# Altium schematic sheet H0AR6_Frontend.SchDoc
size Letter; CompanyName: Hexabitz; DocumentNumber: 3; SheetNumber: 2; SheetTotal: 2
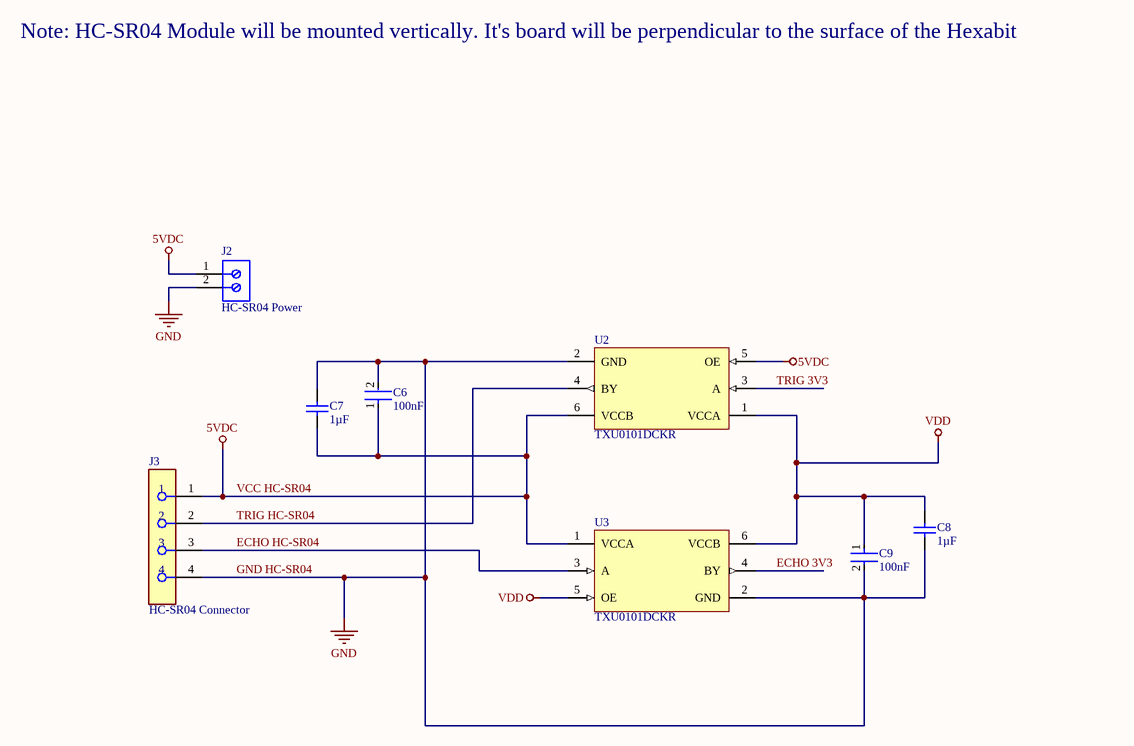
[diagram p0: H0AR6_Frontend.SchDoc]

## Parts
C6  100nF  [FP-0603-L_1_6_0_15-W_0_81-MFG]
C7  1µF  [CAPC1608X90X35LL15T15]
C8  1µF  [CAPC1608X90X35LL15T15]
C9  100nF  [FP-0603-L_1_6_0_15-W_0_81-MFG]
J2  HC-SR04 Power  [691214110002]
J3  HC-SR04 Connector  [FP-SSW-104-02-G-S-MFG]
U2  TXU0101DCKR  [FP-DCK0006A-MFG]
U3  TXU0101DCKR  [FP-DCK0006A-MFG]

## Nets
GND HC-SR04: C6.2 C7.2 C8.2 C9.2 J2.2 J3.4 U2.2(GND) U3.2(GND)  [also labelled GND]
VCC HC-SR04: C6.1 C7.1 J2.1 J3.1 U2.5(OE) U2.6(VCCB) U3.1(VCCA)  [also labelled 5VDC]
VDD: C8.1 C9.1 U2.1(VCCA) U3.5(OE) U3.6(VCCB)
ECHO 3V3: U3.4(BY)
ECHO HC-SR04: J3.3 U3.3(A)
TRIG 3V3: U2.3(A)
TRIG HC-SR04: J3.2 U2.4(BY)

## Notes on the sheet
- Note: HC-SR04 Module will be mounted vertically. It's board will be perpendicular to the surface of the Hexabit
- Module:
- Title:
- Description:
- Size:
- Revision:
- Letter
- www.hexabitz.com
- Date:
- Time:
- Sheet
- of

## Library data of the parts
C6 C9 = CMP-1035-02592-4: General Purpose Ceramic Capacitor, 0603, 100nF, 10%, X7R, 15%, 50V; Manufacturer: KYOCERA AVX; Manufacturer Part Number: 06035C104KAT2A; Dissipation Factor: 2.5%; Radiation Hardening: No; Termination: SMD/SMT; Tolerance: 10%; Lead Free: Lead Free; Width: 0.81mm; Max Operating Temperature: 125°C; Thickness: 0.035inch; Voltage Rating: 50V; Height: 0.9mm; Case/Package: 0603; Depth: 0.81mm; Number of Pins: 2; Capacitance: 100nF; REACH SVHC: No SVHC; Case Code (Imperial): 0603; Voltage: 50V; Voltage Rating (DC): 50V; Mount: Surface Mount; Length: 1.6mm; Min Operating Temperature: -55°C; Packaging: Tape and Reel; Case Code (Metric): 1608; Dielectric Material: Ceramic; Package Quantity: 1; Dielectric: X7R; Contact Plating: Tin; Supplier: Future Electronics; Supplier Part Number: 5411970; RoHS: Compliant; Category: Ceramic Capacitors; Stock: 4736000; Pricing: 4000=0.0065, 16000=0.0062, 40000=0.0061, 100000=0.0059, 160000=0.0057 (USD); Value: 100nF; China RoHS: Compliant; Lifecycle Status: Production; Material: Ceramic; Mounting Technology: Surface Mount; Pins: 2; Number of Terminals: 2; Schedule B: 8532240020; Voltage Rating (AC): 50V; ComponentLink1URL: https://datasheet.octopart.com:443/06035C104KAT2A-KYOCERA-AVX-datasheet-170560559.pdf?src-supplier=IHS; ComponentLink1Description: https://datasheet.octopart.com:443/06035C104KAT2A-KYOCERA-AVX-datasheet-170560559.pdf?src-supplier=IHS; ComponentLink2URL: https://datasheet.octopart.com:443/06035C104KAT2A-AVX-datasheet-12587061.pdf?src-supplier=Upverter; ComponentLink2Description: https://datasheet.octopart.com:443/06035C104KAT2A-AVX-datasheet-12587061.pdf?src-supplier=Upverter; ComponentLink3URL: https://datasheet.octopart.com:443/06035C104KAT2A-AVX-datasheet-167033.pdf?src-supplier=Upverter; ComponentLink3Description: https://datasheet.octopart.com:443/06035C104KAT2A-AVX-datasheet-167033.pdf?src-supplier=Upverter; ComponentLink4URL: https://datasheet.octopart.com:443/06035C104KAT2A-AVX-datasheet-12509786.pdf?src-supplier=Upverter; ComponentLink4Description: https://datasheet.octopart.com:443/06035C104KAT2A-AVX-datasheet-12509786.pdf?src-supplier=Upverter; ComponentLink5URL: https://datasheet.octopart.com:443/06035C104KAT2A-AVX-datasheet-8113618.pdf?src-supplier=Upverter; ComponentLink5Description: https://datasheet.octopart.com:443/06035C104KAT2A-AVX-datasheet-8113618.pdf?src-supplier=Upverter; ComponentLink6URL: https://datasheet.octopart.com:443/06035C104KAT2A-AVX-datasheet-5313617.pdf?src-supplier=Upverter; ComponentLink6Description: https://datasheet.octopart.com:443/06035C104KAT2A-AVX-datasheet-5313617.pdf?src-supplier=Upverter; ComponentLink7URL: https://datasheet.octopart.com:443/06035C104KAT2A-KYOCERA-AVX-datasheet-50865067.pdf?src-supplier=Upverter; ComponentLink7Description: https://datasheet.octopart.com:443/06035C104KAT2A-KYOCERA-AVX-datasheet-50865067.pdf?src-supplier=Upverter; ComponentLink8URL: https://sigma.octopart.com:443/147443767/technical_drawing/AVX-06035C104KAT2A.pdf?src-supplier=Upverter; ComponentLink8Description: https://sigma.octopart.com:443/147443767/technical_drawing/AVX-06035C104KAT2A.pdf?src-supplier=Upverter; ComponentLink9URL: https://datasheet.octopart.com:443/06035C104KAT2A-AVX-datasheet-59261641.pdf?src-supplier=Upverter; ComponentLink9Description: https://datasheet.octopart.com:443/06035C104KAT2A-AVX-datasheet-59261641.pdf?src-supplier=Upverter; ComponentLink10URL: https://datasheet.octopart.com:443/06035C104KAT2A-KYOCERA-AVX-datasheet-158983632.pdf?src-supplier=Newark; ComponentLink10Description: https://datasheet.octopart.com:443/06035C104KAT2A-KYOCERA-AVX-datasheet-158983632.pdf?src-supplier=Newark; ComponentLink11URL: https://datasheet.octopart.com:443/06035C104KAT2A-AVX-datasheet-78690206.pdf?src-supplier=Newark; ComponentLink11Description: https://datasheet.octopart.com:443/06035C104KAT2A-AVX-datasheet-78690206.pdf?src-supplier=Newark; ComponentLink12URL: https://datasheet.octopart.com:443/06035C104KAT2A-KYOCERA-AVX-datasheet-65931687.pdf?src-supplier=Newark; ComponentLink12Description: https://datasheet.octopart.com:443/06035C104KAT2A-KYOCERA-AVX-datasheet-65931687.pdf?src-supplier=Newark; ComponentLink13URL: https://datasheet.octopart.com/06035C104KAT2A-AVX---Kyocera-datasheet-13516023.pdf; ComponentLink13Description: https://datasheet.octopart.com/06035C104KAT2A-AVX---Kyocera-datasheet-13516023.pdf; ComponentLink14URL: https://datasheet.octopart.com/Commercial-Surface-Mount-Chips---X7R-Dielectric-AVX-datasheet-family-100.pdf; ComponentLink14Description: https://datasheet.octopart.com/Commercial-Surface-Mount-Chips---X7R-Dielectric-AVX-datasheet-family-100.pdf; ComponentLink15URL: https://datasheet.octopart.com:443/06035C104KAT2A-AVX---Kyocera-datasheet-8446237.pdf?src-supplier=TME; ComponentLink15Description: https://datasheet.octopart.com:443/06035C104KAT2A-AVX---Kyocera-datasheet-8446237.pdf?src-supplier=TME; ComponentLink16URL: https://datasheet.octopart.com:443/06035C104KAT2A-AVX-datasheet-148183.pdf?src-supplier=TME; ComponentLink16Description: https://datasheet.octopart.com:443/06035C104KAT2A-AVX-datasheet-148183.pdf?src-supplier=TME; ComponentLink17URL: https://datasheet.octopart.com:443/06035C104KAT2A-KYOCERA-AVX-datasheet-156093841.pdf?src-supplier=TME; ComponentLink17Description: https://datasheet.octopart.com:443/06035C104KAT2A-KYOCERA-AVX-datasheet-156093841.pdf?src-supplier=TME; ComponentLink18URL: https://datasheet.octopart.com:443/06035C104KAT2A-AVX-datasheet-166051239.pdf?src-supplier=Amar+Radio+Corporation; ComponentLink18Description: https://datasheet.octopart.com:443/06035C104KAT2A-AVX-datasheet-166051239.pdf?src-supplier=Amar+Radio+Corporation; ComponentLink19URL: https://datasheet.octopart.com:443/06035C104KAT2A-AVX-datasheet-136835410.pdf?src-supplier=SOS+electronic; ComponentLink19Description: https://datasheet.octopart.com:443/06035C104KAT2A-AVX-datasheet-136835410.pdf?src-supplier=SOS+electronic; ComponentLink20URL: https://datasheet.octopart.com:443/06035C104KAT2A-AVX-datasheet-11546901.pdf?src-supplier=Arrow+Electronics; ComponentLink20Description: https://datasheet.octopart.com:443/06035C104KAT2A-AVX-datasheet-11546901.pdf?src-supplier=Arrow+Electronics; ComponentLink21URL: https://datasheet.octopart.com:443/06035C104KAT2A-AVX-datasheet-8316804.pdf?src-supplier=Garrett; ComponentLink21Description: https://datasheet.octopart.com:443/06035C104KAT2A-AVX-datasheet-8316804.pdf?src-supplier=Garrett; ComponentLink22URL: https://datasheet.octopart.com:443/06035C104KAT2A-AVX-datasheet-5383.pdf?src-supplier=Garrett; ComponentLink22Description: https://datasheet.octopart.com:443/06035C104KAT2A-AVX-datasheet-5383.pdf?src-supplier=Garrett; ComponentLink23URL: https://datasheet.octopart.com:443/06035C104KAT2A-AVX-datasheet-7834807.pdf?src-supplier=Jameco; ComponentLink23Description: https://datasheet.octopart.com:443/06035C104KAT2A-AVX-datasheet-7834807.pdf?src-supplier=Jameco; ComponentLink24URL: https://datasheet.octopart.com:443/06035C104KAT2A-AVX-datasheet-119053.pdf?src-supplier=Farnell; ComponentLink24Description: https://datasheet.octopart.com:443/06035C104KAT2A-AVX-datasheet-119053.pdf?src-supplier=Farnell; ComponentLink25URL: https://datasheet.octopart.com:443/06035C104KAT2A-AVX-datasheet-499018.pdf?src-supplier=Farnell; ComponentLink25Description: https://datasheet.octopart.com:443/06035C104KAT2A-AVX-datasheet-499018.pdf?src-supplier=Farnell; ComponentLink26URL: https://datasheet.octopart.com:443/06035C104KAT2A-AVX-datasheet-4352.pdf?src-supplier=RS+(Formerly+Allied+Electronics); ComponentLink26Description: https://datasheet.octopart.com:443/06035C104KAT2A-AVX-datasheet-4352.pdf?src-supplier=RS+(Formerly+Allied+Electronics); ComponentLink27URL: http://sigma.octopart.com:80/reach_statement/AVX-company-19.pdf?src-supplier=Compliance+Statements; ComponentLink27Description: http://sigma.octopart.com:80/reach_statement/AVX-company-19.pdf?src-supplier=Compliance+Statements; ComponentLink28URL: http://sigma.octopart.com:80/conflict_mineral_statement/AVX-company-34.pdf?src-supplier=Compliance+Statements; ComponentLink28Description: http://sigma.octopart.com:80/conflict_mineral_statement/AVX-company-34.pdf?src-supplier=Compliance+Statements
C7 C8 = CMP-2006-02298-2: Manufacturer: Kemet; Part Number: C0603C105K4RACTU; Dielectric: X7R; Dielectric Material: Ceramic; Dissipation Factor: 3.5%; Tolerance: 10%; Voltage: 16V; Supplier: Avnet; Supplier Part Number: C0603C105K4RACTU; Manufacturer Part Number: C0603C105K4RACTU; RoHS: Compliant; Category: Ceramic Capacitors; Stock: 276000; Pricing: 4000=0.0092, 8000=0.00897, 16000=0.00869, 32000=0.00842, 64000=0.00826 (USD); Value: 1µF; Case/Package: 0603; Case Code (Imperial): 0603; Case Code (Metric): 1608; China RoHS: Compliant; Contact Plating: Tin; Depth: 800µm; Height: 800µm; Length: 1.6mm; Lifecycle Status: Production; Material: Ceramic; Max Operating Temperature: 125°C; Min Operating Temperature: -55°C; Mounting Technology: Surface Mount; Pins: 2; Number of Terminals: 2; Packaging: Cut Tape; Radiation Hardening: No; REACH SVHC: Yes; Schedule B: 8532240020, 8532240020|8532240020|8532240020|8532240020|8532240020; Termination: SMD/SMT; Thickness: 889µm; Voltage Rating: 16V; Voltage Rating (DC): 16V; Width: 800µm; ComponentLink1URL: https://datasheet.octopart.com:443/C0603C105K4RACTU-KEMET-datasheet-178445679.pdf?src-supplier=IHS; ComponentLink1Description: https://datasheet.octopart.com:443/C0603C105K4RACTU-KEMET-datasheet-178445679.pdf?src-supplier=IHS; ComponentLink2URL: https://datasheet.octopart.com:443/C0603C105K4RACTU-KEMET-datasheet-137357759.pdf?src-supplier=Farnell; ComponentLink2Description: https://datasheet.octopart.com:443/C0603C105K4RACTU-KEMET-datasheet-137357759.pdf?src-supplier=Farnell; ComponentLink3URL: https://datasheet.octopart.com:443/C0603C105K4RACTU-Kemet-datasheet-8764837.pdf?src-supplier=Farnell; ComponentLink3Description: https://datasheet.octopart.com:443/C0603C105K4RACTU-Kemet-datasheet-8764837.pdf?src-supplier=Farnell; ComponentLink4URL: https://datasheet.octopart.com:443/C0603C105K4RACTU-Kemet-datasheet-8480123.pdf?src-supplier=Farnell; ComponentLink4Description: https://datasheet.octopart.com:443/C0603C105K4RACTU-Kemet-datasheet-8480123.pdf?src-supplier=Farnell; ComponentLink5URL: https://datasheet.octopart.com:443/C0603C105K4RAC-TU.-Kemet-datasheet-5313890.pdf?src-supplier=Farnell; ComponentLink5Description: https://datasheet.octopart.com:443/C0603C105K4RAC-TU.-Kemet-datasheet-5313890.pdf?src-supplier=Farnell; ComponentLink6URL: https://datasheet.octopart.com:443/C0603C105K4RAC-TU-Kemet-datasheet-5390537.pdf?src-supplier=Farnell; ComponentLink6Description: https://datasheet.octopart.com:443/C0603C105K4RAC-TU-Kemet-datasheet-5390537.pdf?src-supplier=Farnell; ComponentLink7URL: https://datasheet.octopart.com:443/C0603C105K4RACTU-Kemet-datasheet-5393970.pdf?src-supplier=Farnell; ComponentLink7Description: https://datasheet.octopart.com:443/C0603C105K4RACTU-Kemet-datasheet-5393970.pdf?src-supplier=Farnell; ComponentLink8URL: https://datasheet.octopart.com:443/C0603C105K4RACTU-Kemet-datasheet-8502025.pdf?src-supplier=Farnell; ComponentLink8Description: https://datasheet.octopart.com:443/C0603C105K4RACTU-Kemet-datasheet-8502025.pdf?src-supplier=Farnell; ComponentLink9URL: https://datasheet.octopart.com:443/C0603C105K4RAC-TU-Kemet-datasheet-7541751.pdf?src-supplier=Farnell; ComponentLink9Description: https://datasheet.octopart.com:443/C0603C105K4RAC-TU-Kemet-datasheet-7541751.pdf?src-supplier=Farnell; ComponentLink10URL: https://datasheet.octopart.com:443/C0603C105K4RACTU-Kemet-datasheet-161801.pdf?src-supplier=Farnell; ComponentLink10Description: https://datasheet.octopart.com:443/C0603C105K4RACTU-Kemet-datasheet-161801.pdf?src-supplier=Farnell; ComponentLink11URL: https://datasheet.octopart.com:443/C0603C105K4RACTU-KEMET-datasheet-101575666.pdf?src-supplier=Farnell; ComponentLink11Description: https://datasheet.octopart.com:443/C0603C105K4RACTU-KEMET-datasheet-101575666.pdf?src-supplier=Farnell; ComponentLink12URL: https://datasheet.octopart.com:443/C0603C105K4RAC-TU-Kemet-datasheet-7833651.pdf?src-supplier=Farnell; ComponentLink12Description: https://datasheet.octopart.com:443/C0603C105K4RAC-TU-Kemet-datasheet-7833651.pdf?src-supplier=Farnell; ComponentLink13URL: https://datasheet.octopart.com:443/C0603C105K4RAC-TU-Kemet-datasheet-7601896.pdf?src-supplier=Farnell; ComponentLink13Description: https://datasheet.octopart.com:443/C0603C105K4RAC-TU-Kemet-datasheet-7601896.pdf?src-supplier=Farnell; ComponentLink14URL: https://datasheet.octopart.com:443/C0603C105K4RAC-TU-Kemet-datasheet-5316294.pdf?src-supplier=Farnell; ComponentLink14Description: https://datasheet.octopart.com:443/C0603C105K4RAC-TU-Kemet-datasheet-5316294.pdf?src-supplier=Farnell; ComponentLink15URL: https://datasheet.octopart.com:443/C0603C105K4RAC-TU-Kemet-datasheet-5314837.pdf?src-supplier=Farnell; ComponentLink15Description: https://datasheet.octopart.com:443/C0603C105K4RAC-TU-Kemet-datasheet-5314837.pdf?src-supplier=Farnell; ComponentLink16URL: https://datasheet.octopart.com:443/C0603C105K4RAC-TU-Kemet-datasheet-8092359.pdf?src-supplier=Farnell; ComponentLink16Description: https://datasheet.octopart.com:443/C0603C105K4RAC-TU-Kemet-datasheet-8092359.pdf?src-supplier=Farnell; ComponentLink17URL: https://datasheet.octopart.com:443/C0603C105K4RAC-TU-Kemet-datasheet-5314449.pdf?src-supplier=Farnell; ComponentLink17Description: https://datasheet.octopart.com:443/C0603C105K4RAC-TU-Kemet-datasheet-5314449.pdf?src-supplier=Farnell; ComponentLink18URL: https://datasheet.octopart.com:443/C0603C105K4RAC-TU-Kemet-datasheet-5314969.pdf?src-supplier=Farnell; ComponentLink18Description: https://datasheet.octopart.com:443/C0603C105K4RAC-TU-Kemet-datasheet-5314969.pdf?src-supplier=Farnell; ComponentLink19URL: https://datasheet.octopart.com:443/C0603C105K4RAC-TU-Kemet-datasheet-5314627.pdf?src-supplier=Farnell; ComponentLink19Description: https://datasheet.octopart.com:443/C0603C105K4RAC-TU-Kemet-datasheet-5314627.pdf?src-supplier=Farnell; ComponentLink20URL: https://datasheet.octopart.com:443/C0603C105K4RAC-TU-Kemet-datasheet-5389132.pdf?src-supplier=Farnell; ComponentLink20Description: https://datasheet.octopart.com:443/C0603C105K4RAC-TU-Kemet-datasheet-5389132.pdf?src-supplier=Farnell; ComponentLink21URL: https://datasheet.octopart.com:443/C0603C105K4RAC-TU-Kemet-datasheet-5313836.pdf?src-supplier=Farnell; ComponentLink21Description: https://datasheet.octopart.com:443/C0603C105K4RAC-TU-Kemet-datasheet-5313836.pdf?src-supplier=Farnell; ComponentLink22URL: https://datasheet.octopart.com:443/C0603C105K4RAC-TU-Kemet-datasheet-8111010.pdf?src-supplier=Farnell; ComponentLink22Description: https://datasheet.octopart.com:443/C0603C105K4RAC-TU-Kemet-datasheet-8111010.pdf?src-supplier=Farnell; ComponentLink23URL: https://datasheet.octopart.com:443/C0603C105K4RAC-TU-Kemet-datasheet-7627733.pdf?src-supplier=Farnell; ComponentLink23Description: https://datasheet.octopart.com:443/C0603C105K4RAC-TU-Kemet-datasheet-7627733.pdf?src-supplier=Farnell; ComponentLink24URL: https://datasheet.octopart.com:443/C0603C105K4RAC-TU-Kemet-datasheet-5315946.pdf?src-supplier=Farnell; ComponentLink24Description: https://datasheet.octopart.com:443/C0603C105K4RAC-TU-Kemet-datasheet-5315946.pdf?src-supplier=Farnell; ComponentLink25URL: https://datasheet.octopart.com:443/C0603C105K4RAC7867-KEMET-datasheet-188512054.pdf?src-supplier=ODG+(Origin+Data+Global); ComponentLink25Description: https://datasheet.octopart.com:443/C0603C105K4RAC7867-KEMET-datasheet-188512054.pdf?src-supplier=ODG+(Origin+Data+Global); ComponentLink26URL: https://datasheet.octopart.com:443/C0603C105K4RACTU-KEMET-datasheet-157246124.pdf?src-supplier=Electro+Sonic; ComponentLink26Description: https://datasheet.octopart.com:443/C0603C105K4RACTU-KEMET-datasheet-157246124.pdf?src-supplier=Electro+Sonic; ComponentLink27URL: https://datasheet.octopart.com:443/C0603C105K4RACTU-KEMET-datasheet-32036385.pdf?src-supplier=Electro+Sonic; ComponentLink27Description: https://datasheet.octopart.com:443/C0603C105K4RACTU-KEMET-datasheet-32036385.pdf?src-supplier=Electro+Sonic; ComponentLink28URL: https://datasheet.octopart.com:443/C0603C105K4RACTU-Kemet-datasheet-22084244.pdf?src-supplier=Newark; ComponentLink28Description: https://datasheet.octopart.com:443/C0603C105K4RACTU-Kemet-datasheet-22084244.pdf?src-supplier=Newark; ComponentLink29URL: https://datasheet.octopart.com:443/C0603C105K4RACTU-Kemet-datasheet-12608295.pdf?src-supplier=Newark; ComponentLink29Description: https://datasheet.octopart.com:443/C0603C105K4RACTU-Kemet-datasheet-12608295.pdf?src-supplier=Newark; ComponentLink30URL: https://datasheet.octopart.com:443/C0603C105K4RACTU-Kemet-datasheet-11992184.pdf?src-supplier=Newark; ComponentLink30Description: https://datasheet.octopart.com:443/C0603C105K4RACTU-Kemet-datasheet-11992184.pdf?src-supplier=Newark; ComponentLink31URL: https://datasheet.octopart.com:443/C0603C105K4RACTU-Kemet-datasheet-10942409.pdf?src-supplier=Newark; ComponentLink31Description: https://datasheet.octopart.com:443/C0603C105K4RACTU-Kemet-datasheet-10942409.pdf?src-supplier=Newark; ComponentLink32URL: https://datasheet.octopart.com:443/C0603C105K4RACTU-Kemet-datasheet-10404442.pdf?src-supplier=Newark; ComponentLink32Description: https://datasheet.octopart.com:443/C0603C105K4RACTU-Kemet-datasheet-10404442.pdf?src-supplier=Newark; ComponentLink33URL: https://datasheet.octopart.com:443/C0603C105K4RACTU-KEMET-datasheet-164512540.pdf?src-supplier=TME; ComponentLink33Description: https://datasheet.octopart.com:443/C0603C105K4RACTU-KEMET-datasheet-164512540.pdf?src-supplier=TME; ComponentLink34URL: https://datasheet.octopart.com:443/C0603C105K4RACTU-KEMET-datasheet-68311255.pdf?src-supplier=TME; ComponentLink34Description: https://datasheet.octopart.com:443/C0603C105K4RACTU-KEMET-datasheet-68311255.pdf?src-supplier=TME; ComponentLink35URL: https://datasheet.octopart.com:443/C0603C105K4RACTU-KEMET-datasheet-68331906.pdf?src-supplier=TME; ComponentLink35Description: https://datasheet.octopart.com:443/C0603C105K4RACTU-KEMET-datasheet-68331906.pdf?src-supplier=TME; ComponentLink36URL: https://datasheet.octopart.com:443/C0603C105K4RACTU-KEMET-datasheet-110724412.pdf?src-supplier=RS+(Formerly+Allied+Electronics); ComponentLink36Description: https://datasheet.octopart.com:443/C0603C105K4RACTU-KEMET-datasheet-110724412.pdf?src-supplier=RS+(Formerly+Allied+Electronics); ComponentLink37URL: https://datasheet.octopart.com:443/C0603C105K4RACTU-Kemet-datasheet-60243841.pdf?src-supplier=RS+(Formerly+Allied+Electronics); ComponentLink37Description: https://datasheet.octopart.com:443/C0603C105K4RACTU-Kemet-datasheet-60243841.pdf?src-supplier=RS+(Formerly+Allied+Electronics); ComponentLink38URL: https://datasheet.octopart.com/C0603C105K4RACTU-KEMET-datasheet-84169754.pdf; ComponentLink38Description: https://datasheet.octopart.com/C0603C105K4RACTU-KEMET-datasheet-84169754.pdf; ComponentLink39URL: https://datasheet.octopart.com:443/C0603C105K4RACTU-Kemet-datasheet-24570007.pdf?src-supplier=element14+APAC; ComponentLink39Description: https://datasheet.octopart.com:443/C0603C105K4RACTU-Kemet-datasheet-24570007.pdf?src-supplier=element14+APAC; ComponentLink40URL: https://datasheet.octopart.com:443/C0603C105K4RACTU-Kemet-datasheet-21389240.pdf?src-supplier=element14+APAC; ComponentLink40Description: https://datasheet.octopart.com:443/C0603C105K4RACTU-Kemet-datasheet-21389240.pdf?src-supplier=element14+APAC; ComponentLink41URL: https://datasheet.octopart.com:443/C0603C105K4RACTU-Kemet-datasheet-11546808.pdf?src-supplier=Arrow+Electronics; ComponentLink41Description: https://datasheet.octopart.com:443/C0603C105K4RACTU-Kemet-datasheet-11546808.pdf?src-supplier=Arrow+Electronics; ComponentLink42URL: https://datasheet.octopart.com:443/C0603C105K4RAC7867-KEMET-datasheet-164857143.pdf?src-supplier=Burklin+Elektronik; ComponentLink42Description: https://datasheet.octopart.com:443/C0603C105K4RAC7867-KEMET-datasheet-164857143.pdf?src-supplier=Burklin+Elektronik
J2 = CMP-1502-02464-2: NexarPartId: 18818288; Plating: Brass, Steel; Current: 10A; Pitch: 3.5052mm; Number of Levels: 1; Number of Contacts: 2; Wire Gauge (Min): 16AWG; Voltage: 300V; Wire Gauge (Max): 24AWG; Stripping Length: -6mm; Number of Pins: 2; Number of Rows: 1; REACH SVHC: Unknown; RoHS: Compliant; Housing Material: Nylon; Termination: Screw; Mount: Through Hole; Contact Plating: Brass, Tin; Number of Positions Per Level: 2; Color: Blue, Green; Width: 7.9mm; Voltage Rating: 300V; Length: 7.4mm; Current Rating: 10A; Wire/Cable Gauge: 24AWG; Packaging: Box; Max Operating Temperature: 105°C; Lead Pitch: 3.5mm; Height: 8.7mm; Contact Material: Brass; Min Operating Temperature: -40°C
J3 = CMP-00575-00296407-1: SSW-104-02-G-S Board to Board & Mezzanine Connectors Tiger Buy Socket Strip with PCB Tails, .100 Pitch; NexarPartId: 296407; Manufacturer Lifecycle Status: PRODUCTION; Manufacturer: Samtec; Gender: Receptacle; Pitch: 2.54mm; Number of Positions: 4; Contact Resistance: 10mΩ; Connector Type: Receptacle, Socket; Voltage Rating: 550V; Max Current Rating: 6.9A; Voltage Rating (DC): 655V; Voltage Rating (AC): 465V; Current Rating: 4.7A; RoHS: Compliant; Lead Pitch: 2.54mm; Min Operating Temperature: -55°C; Housing Material: Polymer; Length: 10.67mm; Mount: Through Hole; Orientation: Straight; Lifecycle Status: Production; Lead Free: Lead Free; REACH SVHC: No SVHC; Number of Rows: 1; Contact Plating: Gold; Radiation Hardening: No; Max Operating Temperature: 125°C; Housing Color: Black; Height: 8.64mm; Contact Material: Bronze, Gold, Nickel; Width: 2.41mm; Number of Contacts: 4; Packaging: Bulk; Termination: Solder; Depth: 2.41mm; Max Voltage Rating (AC): 550V; Color: Black; Supplier: Avnet; Supplier Part Number: SSW-104-02-G-S; Manufacturer Part Number: SSW-104-02-G-S; Category: Headers and Wire Housings; Stock: 1239; Pricing: 1=1.372, 10=1.365, 30=0.96486, 50=0.95989, 100=0.95491 (USD); Mounting Technology: Through Hole; ComponentLink1URL: https://sigma.octopart.com:443/153594225/technical_drawing/Samtec-SSW-104-02-G-S.pdf?src-supplier=Upverter; ComponentLink1Description: https://sigma.octopart.com:443/153594225/technical_drawing/Samtec-SSW-104-02-G-S.pdf?src-supplier=Upverter; ComponentLink2URL: https://datasheet.octopart.com:443/SSW-104-02-G-S-Samtec-datasheet-153594224.pdf?src-supplier=Upverter; ComponentLink2Description: https://datasheet.octopart.com:443/SSW-104-02-G-S-Samtec-datasheet-153594224.pdf?src-supplier=Upverter; ComponentLink3URL: https://datasheet.octopart.com:443/SSW-104-02-G-S-Samtec-datasheet-97292260.pdf?src-supplier=Samtec; ComponentLink3Description: https://datasheet.octopart.com:443/SSW-104-02-G-S-Samtec-datasheet-97292260.pdf?src-supplier=Samtec; ComponentLink4URL: https://sigma.octopart.com:443/97292261/technical_drawing/Samtec-SSW-104-02-G-S.pdf?src-supplier=Samtec; ComponentLink4Description: https://sigma.octopart.com:443/97292261/technical_drawing/Samtec-SSW-104-02-G-S.pdf?src-supplier=Samtec; ComponentLink5URL: https://datasheet.octopart.com:443/SSW-104-02-G-S-Samtec-datasheet-150000281.pdf?src-supplier=Master+Electronics; ComponentLink5Description: https://datasheet.octopart.com:443/SSW-104-02-G-S-Samtec-datasheet-150000281.pdf?src-supplier=Master+Electronics; ComponentLink6URL: https://datasheet.octopart.com:443/SSW-104-02-G-S-Samtec-datasheet-118235310.pdf?src-supplier=Electro+Sonic; ComponentLink6Description: https://datasheet.octopart.com:443/SSW-104-02-G-S-Samtec-datasheet-118235310.pdf?src-supplier=Electro+Sonic; ComponentLink7URL: https://datasheet.octopart.com:443/SSW-104-02-G-S-Samtec-datasheet-97291133.pdf?src-supplier=Farnell; ComponentLink7Description: https://datasheet.octopart.com:443/SSW-104-02-G-S-Samtec-datasheet-97291133.pdf?src-supplier=Farnell; ComponentLink8URL: https://datasheet.octopart.com:443/SSW-104-02-G-S-Samtec-datasheet-5312073.pdf?src-supplier=Farnell; ComponentLink8Description: https://datasheet.octopart.com:443/SSW-104-02-G-S-Samtec-datasheet-5312073.pdf?src-supplier=Farnell; ComponentLink9URL: https://datasheet.octopart.com:443/SSW-104-02-G-S-Samtec-datasheet-5300226.pdf?src-supplier=Newark; ComponentLink9Description: https://datasheet.octopart.com:443/SSW-104-02-G-S-Samtec-datasheet-5300226.pdf?src-supplier=Newark; ComponentLink10URL: https://datasheet.octopart.com:443/SSW-104-02-G-S-Samtec-datasheet-171398496.pdf?src-supplier=JRH+Electronics; ComponentLink10Description: https://datasheet.octopart.com:443/SSW-104-02-G-S-Samtec-datasheet-171398496.pdf?src-supplier=JRH+Electronics; ComponentLink11URL: https://datasheet.octopart.com:443/SSW-104-02-G-S-Samtec-datasheet-118235309.pdf?src-supplier=Sager+Electronics; ComponentLink11Description: https://datasheet.octopart.com:443/SSW-104-02-G-S-Samtec-datasheet-118235309.pdf?src-supplier=Sager+Electronics; ComponentLink12URL: https://datasheet.octopart.com/SSW-104-02-G-S-Samtec-datasheet-86818373.pdf; ComponentLink12Description: https://datasheet.octopart.com/SSW-104-02-G-S-Samtec-datasheet-86818373.pdf; ComponentLink13URL: https://datasheet.octopart.com/SSW-104-02-G-S-Samtec-datasheet-17059784.pdf; ComponentLink13Description: https://datasheet.octopart.com/SSW-104-02-G-S-Samtec-datasheet-17059784.pdf; ComponentLink14URL: https://datasheet.octopart.com:443/SSW-104-02-G-S-Samtec-datasheet-62331924.pdf?src-supplier=element14+APAC; ComponentLink14Description: https://datasheet.octopart.com:443/SSW-104-02-G-S-Samtec-datasheet-62331924.pdf?src-supplier=element14+APAC
U2 U3 = CMP-00370-128857311-1: Single channel fixed-direction level shifter 6-SC70 -40 to 125; Manufacturer Lifecycle Status: ACTIVE; Manufacturer: Texas Instruments; Number of Inputs: 1; Propagation Delay: 69ns; Max Junction Temperature (Tj): 150°C; Data Rate: 200Mbps; Nominal Supply Current: 2.5µA; Ambient Temperature Range High: 125°C; Lifecycle Status: Production; Height: 1.1mm; Min Operating Temperature: -40°C; Width: 1.25mm; Number of Pins: 6; Number of Circuits: 1; Thickness: 900µm; Length: 2mm; Max Operating Temperature: 125°C; Number of Outputs: 1; Number of Bits: 1; Supplier: DigiKey; Supplier Part Number: 296-TXU0101DCKRCT-ND; Manufacturer Part Number: TXU0101DCKR; RoHS: Compliant; Category: Voltage Level Shifters; Stock: 20319; Pricing: 1=0.59, 10=0.416, 25=0.3728, 100=0.3249, 250=0.30208, 500=0.28836, 1000=0.28152 (USD); Pins: 6; ComponentLink1URL: https://sigma.octopart.com:443/182282881/technical_drawing/Texas-Instruments-TXU0101DCKR.pdf?src-supplier=Texas+Instruments; ComponentLink1Description: https://sigma.octopart.com:443/182282881/technical_drawing/Texas-Instruments-TXU0101DCKR.pdf?src-supplier=Texas+Instruments; ComponentLink2URL: https://octopart.com:443/opatz8j6/c1?t=a4Hsy8csmqmwz1in6n37KC7Gw8FwFjpVwKbQR1ufDxk4nG-lS8za5dyOG6bCYLFqaMLUjpJXlLnOoy7-d8-hCbclCaMyiT-HFYGyW2llyy_KpI8aMp6M5ydT5AtWJLDEnJbQQ4wzMQxjrbTvuo-7SdgGLrTO_qtWf0OC8_zpQ7QXr6ll_9dfX81jT7ow0bhE0rbz9aXDMi-u9dmU98Q8uDrz6iK3HbcQmZ1D6BOtADI-VNsOi80ZAa8RIhAjPxpQZ1wkz7NqZTRFFFeBTpC-FjVvoBKjFknTR5u0wodEQHr5JfNDvyr9C4fOnA21gZh4xMo2RF1Cz9-DOEkUNj7e3ZfZZ40ZMpPv8_oasMHEedxhTMujYnSwxBgYf1DYko8LvEGtQLkU&src-supplier=Texas+Instruments; ComponentLink2Description: https://octopart.com:443/opatz8j6/c1?t=a4Hsy8csmqmwz1in6n37KC7Gw8FwFjpVwKbQR1ufDxk4nG-lS8za5dyOG6bCYLFqaMLUjpJXlLnOoy7-d8-hCbclCaMyiT-HFYGyW2llyy_KpI8aMp6M5ydT5AtWJLDEnJbQQ4wzMQxjrbTvuo-7SdgGLrTO_qtWf0OC8_zpQ7QXr6ll_9dfX81jT7ow0bhE0rbz9aXDMi-u9dmU98Q8uDrz6iK3HbcQmZ1D6BOtADI-VNsOi80ZAa8RIhAjPxpQZ1wkz7NqZTRFFFeBTpC-FjVvoBKjFknTR5u0wodEQHr5JfNDvyr9C4fOnA21gZh4xMo2RF1Cz9-DOEkUNj7e3ZfZZ40ZMpPv8_oasMHEedxhTMujYnSwxBgYf1DYko8LvEGtQLkU&src-supplier=Texas+Instruments; ComponentLink3URL: https://sigma.octopart.com:443/178868976/technical_drawing/Texas-Instruments-TXU0101DCKR.pdf?src-supplier=Texas+Instruments; ComponentLink3Description: https://sigma.octopart.com:443/178868976/technical_drawing/Texas-Instruments-TXU0101DCKR.pdf?src-supplier=Texas+Instruments; ComponentLink4URL: https://datasheet.octopart.com:443/TXU0101DCKR-Texas-Instruments-datasheet-181199934.pdf?src-supplier=Upverter; ComponentLink4Description: https://datasheet.octopart.com:443/TXU0101DCKR-Texas-Instruments-datasheet-181199934.pdf?src-supplier=Upverter; ComponentLink5URL: http://sigma.octopart.com:80/conflict_mineral_statement/Texas-Instruments-company-63.pdf?src-supplier=Compliance+Statements; ComponentLink5Description: http://sigma.octopart.com:80/conflict_mineral_statement/Texas-Instruments-company-63.pdf?src-supplier=Compliance+Statements; ComponentLink6URL: http://sigma.octopart.com:80/reach_statement/Texas-Instruments-company-64.pdf?src-supplier=Compliance+Statements; ComponentLink6Description: http://sigma.octopart.com:80/reach_statement/Texas-Instruments-company-64.pdf?src-supplier=Compliance+Statements